# EAGLE design XbusTCO_smd (EAGLE 9.2.1)
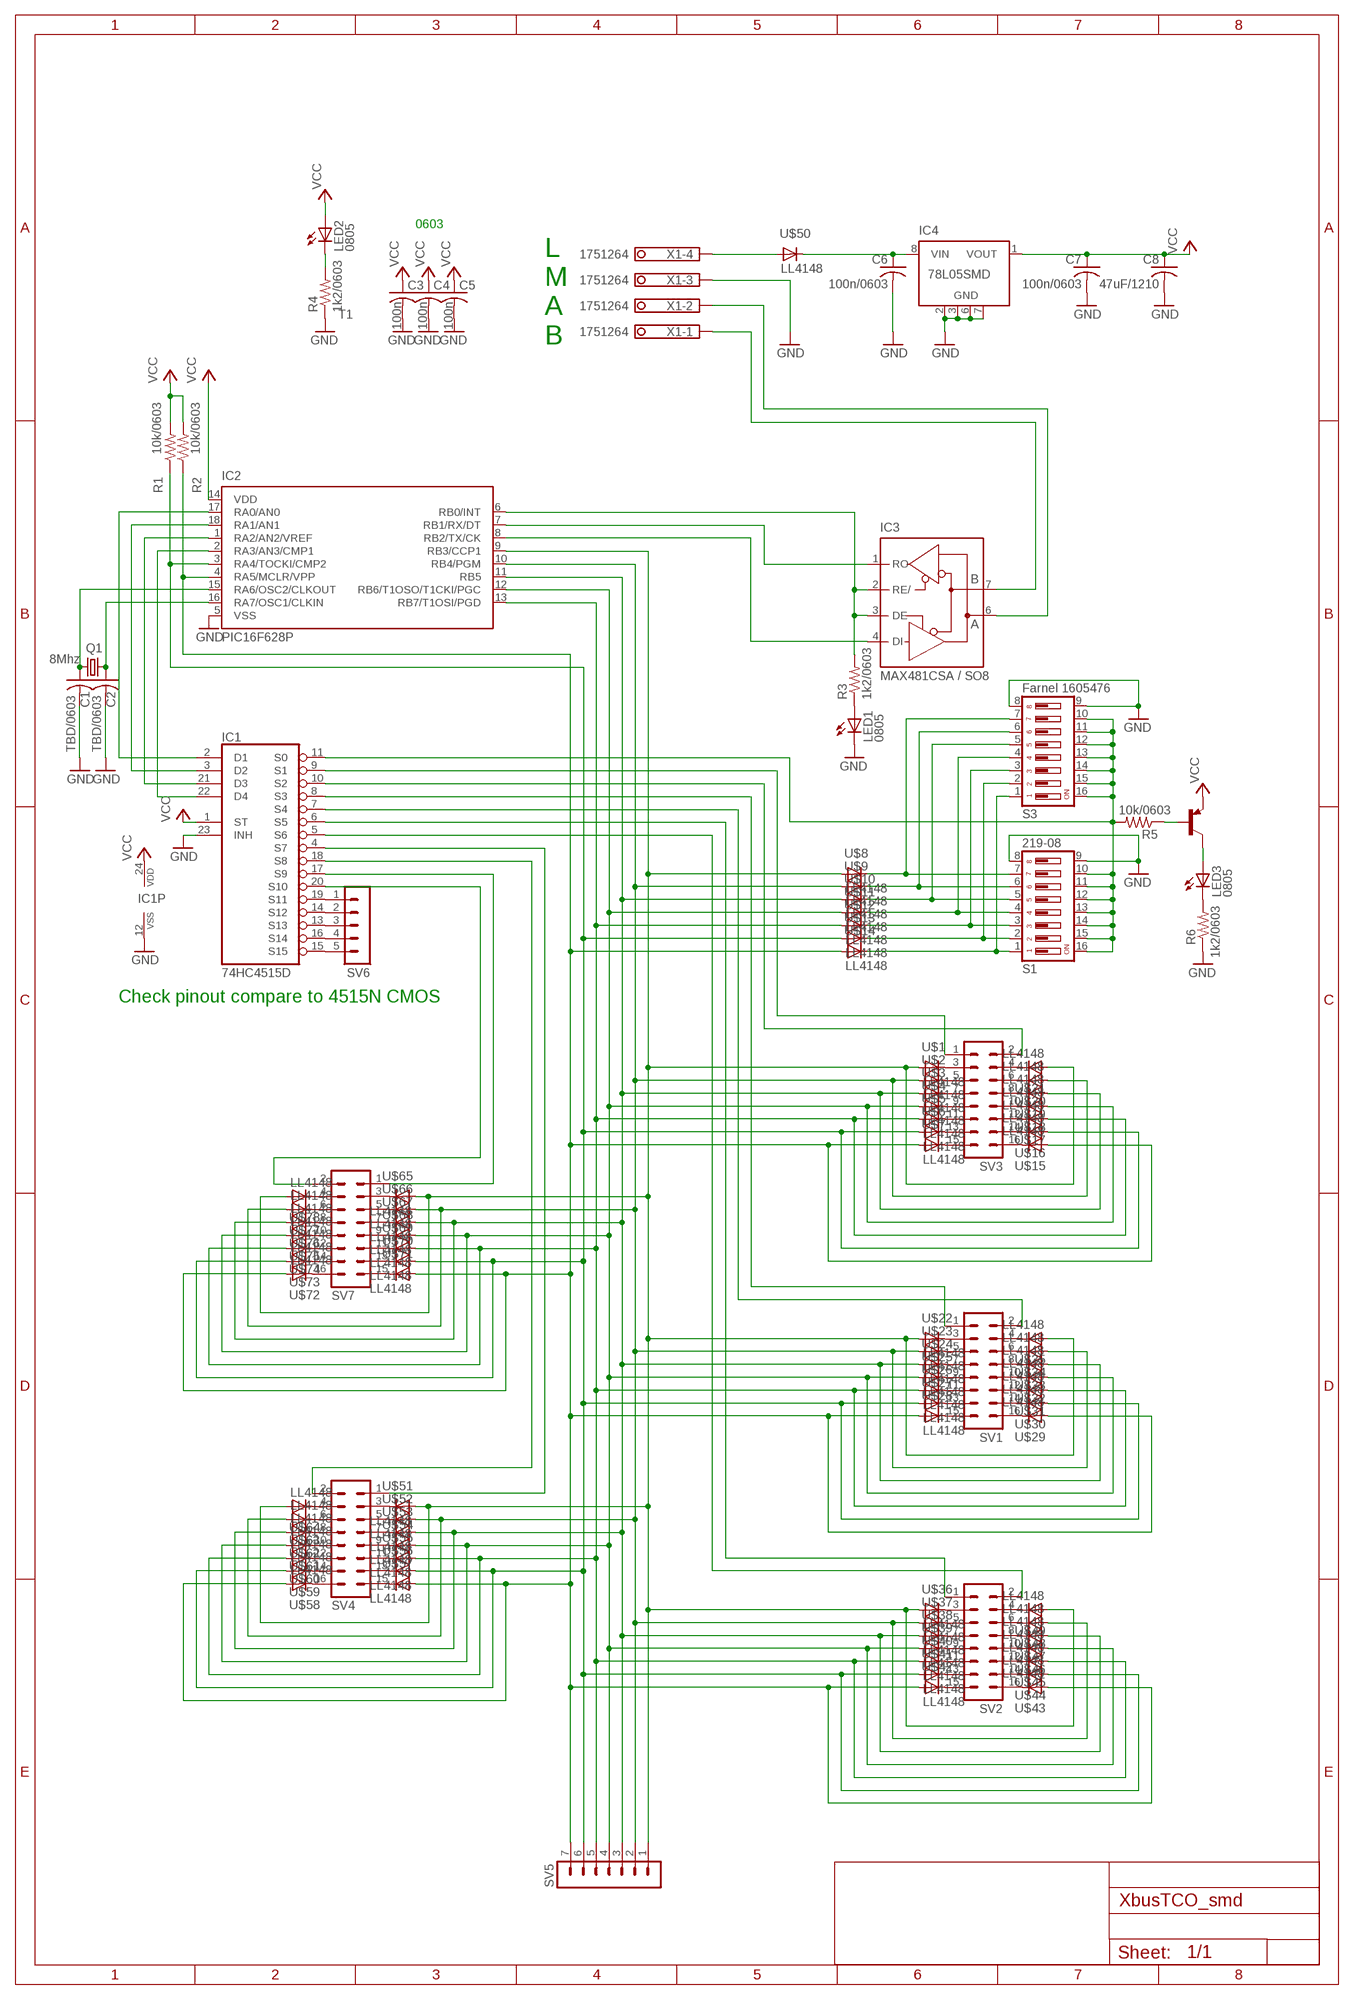
[diagram p0: schematic, sheet 1]

## Parts
C1  TBD/0603  C-USC0603  [C0603]
C2  TBD/0603  C-USC0603  [C0603]
C3  100n  C-USC0603  [C0603]
C4  100n  C-USC0603  [C0603]
C5  100n  C-USC0603  [C0603]
C6  100n/0603  C-USC0603  [C0603]
C7  100n/0603  C-USC0603  [C0603]
C8  47uF/1210  C-USC1210  [C1210]
IC1  74HC4515D  4515D  [SO24W]
IC2  PIC16F628P  [DIL18]
IC3  MAX481CSA / SO8  MAX481CSA  [SO08]
IC4  78L05SMD  [SO08]
LED1  0805  LEDCHIPLED_0805  [CHIPLED_0805]
LED2  0805  LEDCHIPLED_0805  [CHIPLED_0805]
LED3  0805  LEDCHIPLED_0805  [CHIPLED_0805]
Q1  8Mhz  CRYSTALHC49U70  [HC49U70]
R1  10k/0603  R-US_R0603  [R0603]
R2  10k/0603  R-US_R0603  [R0603]
R3  1k2/0603  R-US_R0603  [R0603]
R4  1k2/0603  R-US_R0603  [R0603]
R5  10k/0603  R-US_R0603  [R0603]
R6  1k2/0603  R-US_R0603  [R0603]
S1  219-08  [CTS-219-08]
S3  Farnel 1605476  219-08J  [CTS-219-08J]
SV1  MA08-2W  [MA08-2W]
SV2  MA08-2W  [MA08-2W]
SV3  MA08-2W  [MA08-2W]
SV4  MA08-2W  [MA08-2W]
SV5  MA07-1  [MA07-1]
SV6  MA05-1  [MA05-1]
SV7  MA08-2W  [MA08-2W]
T1  BC857A-PNP-SOT23-BEC  [SOT23-BEC]
U$1  LL4148  [MINIMELF]
U$2  LL4148  [MINIMELF]
U$3  LL4148  [MINIMELF]
U$4  LL4148  [MINIMELF]
U$5  LL4148  [MINIMELF]
U$6  LL4148  [MINIMELF]
U$7  LL4148  [MINIMELF]
U$8  LL4148  [MINIMELF]
U$9  LL4148  [MINIMELF]
U$10  LL4148  [MINIMELF]
U$11  LL4148  [MINIMELF]
U$12  LL4148  [MINIMELF]
U$13  LL4148  [MINIMELF]
U$14  LL4148  [MINIMELF]
U$15  LL4148  [MINIMELF]
U$16  LL4148  [MINIMELF]
U$17  LL4148  [MINIMELF]
U$18  LL4148  [MINIMELF]
U$19  LL4148  [MINIMELF]
U$20  LL4148  [MINIMELF]
U$21  LL4148  [MINIMELF]
U$22  LL4148  [MINIMELF]
U$23  LL4148  [MINIMELF]
U$24  LL4148  [MINIMELF]
U$25  LL4148  [MINIMELF]
U$26  LL4148  [MINIMELF]
U$27  LL4148  [MINIMELF]
U$28  LL4148  [MINIMELF]
U$29  LL4148  [MINIMELF]
U$30  LL4148  [MINIMELF]
U$31  LL4148  [MINIMELF]
U$32  LL4148  [MINIMELF]
U$33  LL4148  [MINIMELF]
U$34  LL4148  [MINIMELF]
U$35  LL4148  [MINIMELF]
U$36  LL4148  [MINIMELF]
U$37  LL4148  [MINIMELF]
U$38  LL4148  [MINIMELF]
U$39  LL4148  [MINIMELF]
U$40  LL4148  [MINIMELF]
U$41  LL4148  [MINIMELF]
U$42  LL4148  [MINIMELF]
U$43  LL4148  [MINIMELF]
U$44  LL4148  [MINIMELF]
U$45  LL4148  [MINIMELF]
U$46  LL4148  [MINIMELF]
U$47  LL4148  [MINIMELF]
U$48  LL4148  [MINIMELF]
U$49  LL4148  [MINIMELF]
U$50  LL4148  [MINIMELF]
U$51  LL4148  [MINIMELF]
U$52  LL4148  [MINIMELF]
U$53  LL4148  [MINIMELF]
U$54  LL4148  [MINIMELF]
U$55  LL4148  [MINIMELF]
U$56  LL4148  [MINIMELF]
U$57  LL4148  [MINIMELF]
U$58  LL4148  [MINIMELF]
U$59  LL4148  [MINIMELF]
U$60  LL4148  [MINIMELF]
U$61  LL4148  [MINIMELF]
U$62  LL4148  [MINIMELF]
U$63  LL4148  [MINIMELF]
U$64  LL4148  [MINIMELF]
U$65  LL4148  [MINIMELF]
U$66  LL4148  [MINIMELF]
U$67  LL4148  [MINIMELF]
U$68  LL4148  [MINIMELF]
U$69  LL4148  [MINIMELF]
U$70  LL4148  [MINIMELF]
U$71  LL4148  [MINIMELF]
U$72  LL4148  [MINIMELF]
U$73  LL4148  [MINIMELF]
U$74  LL4148  [MINIMELF]
U$75  LL4148  [MINIMELF]
U$76  LL4148  [MINIMELF]
U$77  LL4148  [MINIMELF]
U$78  LL4148  [MINIMELF]
X1  1751264  [1751264]

## Nets
GND: C1.2 C2.2 C3.2 C4.2 C5.2 C6.2 C7.2 C8.2 IC1.12(VSS) IC1.23(INH) IC2.5(VSS) IC4.2(GND) IC4.3(GND) IC4.6(GND) IC4.7(GND) LED1.C R4.1 R6.1 S1.8 S1.9 S3.8 S3.9 X1.3
N$1: C1.1 IC2.15(RA6/OSC2/CLKOUT) Q1.2
N$2: C2.1 IC2.16(RA7/OSC1/CLKIN) Q1.1
N$3: IC1.2(D1) IC2.17(RA0/AN0)
N$4: IC1.3(D2) IC2.18(RA1/AN1)
N$5: IC1.21(D3) IC2.1(RA2/AN2/VREF)
N$6: IC1.22(D4) IC2.2(RA3/AN3/CMP1)
N$7: IC2.6(RB0/INT) IC3.2(RE/) IC3.3(DE) R3.2
N$8: IC2.8(RB2/TX/CK) IC3.4(DI)
N$9: IC2.7(RB1/RX/DT) IC3.1(RO)
N$10: IC2.9(RB3/CCP1) SV5.1 U$1.A U$8.A U$21.A U$22.A U$35.A U$36.A U$49.A U$51.A U$64.A U$65.A U$78.A
N$11: IC2.10(RB4/PGM) SV5.2 U$2.A U$9.A U$20.A U$23.A U$34.A U$37.A U$48.A U$52.A U$63.A U$66.A U$77.A
N$12: IC2.11(RB5) SV5.3 U$3.A U$10.A U$19.A U$24.A U$33.A U$38.A U$47.A U$53.A U$62.A U$67.A U$76.A
N$13: IC2.12(RB6/T1OSO/T1CKI/PGC) SV5.4 U$4.A U$11.A U$18.A U$25.A U$32.A U$39.A U$46.A U$54.A U$61.A U$68.A U$75.A
N$14: IC2.13(RB7/T1OSI/PGD) SV5.5 U$5.A U$12.A U$17.A U$26.A U$31.A U$40.A U$45.A U$55.A U$60.A U$69.A U$74.A
N$15: IC2.3(RA4/TOCKI/CMP2) R1.1 SV5.6 U$6.A U$13.A U$16.A U$27.A U$30.A U$41.A U$44.A U$56.A U$59.A U$70.A U$73.A
N$16: IC2.4(RA5/MCLR/VPP) R2.1 SV5.7 U$7.A U$14.A U$15.A U$28.A U$29.A U$42.A U$43.A U$57.A U$58.A U$71.A U$72.A
N$17: IC1.9(S1) SV3.1
N$18: IC1.10(S2) SV3.2
N$19: C6.1 IC4.8(VIN) U$50.C
N$20: U$50.A X1.4
N$21: IC1.6(S5) SV2.1
N$22: IC3.6(A) X1.2
N$23: SV3.3 U$1.C
N$24: SV3.5 U$2.C
N$25: SV3.7 U$3.C
N$26: SV3.9 U$4.C
N$27: SV3.11 U$5.C
N$28: SV3.13 U$6.C
N$29: SV3.15 U$7.C
N$30: IC1.11(S0) R5.2 S1.10 S1.11 S1.12 S1.13 S1.14 S1.15 S1.16 S3.10 S3.11 S3.12 S3.13 S3.14 S3.15 S3.16
N$31: S1.7 S3.7 U$8.C
N$32: S1.6 S3.6 U$9.C
N$33: S1.5 S3.5 U$10.C
N$34: S1.4 S3.4 U$11.C
N$35: S1.3 S3.3 U$12.C
N$36: S1.2 S3.2 U$13.C
N$37: S1.1 S3.1 U$14.C
N$38: SV3.16 U$15.C
N$39: SV3.14 U$16.C
N$40: SV3.12 U$17.C
N$41: SV3.10 U$18.C
N$42: SV3.8 U$19.C
N$43: SV3.6 U$20.C
N$44: SV3.4 U$21.C
N$45: IC3.7(B) X1.1
N$46: LED2.C R4.2
N$47: LED1.A R3.1
N$48: R5.1 T1.B
N$49: LED3.A T1.C
N$50: LED3.C R6.2
N$51: IC1.5(S6) SV2.2
N$52: IC1.8(S3) SV1.1
N$53: IC1.7(S4) SV1.2
N$54: SV1.3 U$22.C
N$55: SV1.5 U$23.C
N$56: SV1.7 U$24.C
N$57: SV1.9 U$25.C
N$58: SV1.11 U$26.C
N$59: SV1.13 U$27.C
N$60: SV1.15 U$28.C
N$61: SV1.16 U$29.C
N$62: SV1.14 U$30.C
N$63: SV1.12 U$31.C
N$64: SV1.10 U$32.C
N$65: SV1.8 U$33.C
N$66: SV1.6 U$34.C
N$67: SV1.4 U$35.C
N$68: SV2.3 U$36.C
N$69: SV2.5 U$37.C
N$70: SV2.7 U$38.C
N$71: SV2.9 U$39.C
N$72: SV2.11 U$40.C
N$73: SV2.13 U$41.C
N$74: SV2.15 U$42.C
N$75: SV2.16 U$43.C
N$76: SV2.14 U$44.C
N$77: SV2.12 U$45.C
N$78: SV2.10 U$46.C
N$79: SV2.8 U$47.C
N$80: SV2.6 U$48.C
N$81: SV2.4 U$49.C
N$82: IC1.4(S7) SV4.1
N$83: IC1.18(S8) SV4.2
N$84: IC1.17(S9) SV7.1
N$85: IC1.20(S10) SV7.2
N$86: IC1.19(S11) SV6.1
N$87: IC1.14(S12) SV6.2
N$88: IC1.13(S13) SV6.3
N$89: IC1.16(S14) SV6.4
N$90: IC1.15(S15) SV6.5
N$96: SV7.3 U$65.C
N$97: SV7.5 U$66.C
N$98: SV4.3 U$51.C
N$99: SV4.5 U$52.C
N$100: SV4.7 U$53.C
N$101: SV4.9 U$54.C
N$102: SV4.11 U$55.C
N$103: SV4.13 U$56.C
N$104: SV4.15 U$57.C
N$105: SV4.16 U$58.C
N$106: SV4.14 U$59.C
N$107: SV4.12 U$60.C
N$108: SV4.10 U$61.C
N$109: SV4.8 U$62.C
N$110: SV4.6 U$63.C
N$111: SV4.4 U$64.C
N$112: SV7.7 U$67.C
N$113: SV7.9 U$68.C
N$114: SV7.11 U$69.C
N$115: SV7.13 U$70.C
N$116: SV7.15 U$71.C
N$117: SV7.16 U$72.C
N$118: SV7.14 U$73.C
N$119: SV7.12 U$74.C
N$120: SV7.10 U$75.C
N$121: SV7.8 U$76.C
N$122: SV7.6 U$77.C
N$123: SV7.4 U$78.C
VCC: C3.1 C4.1 C5.1 C7.1 C8.1 IC1.1(ST) IC1.24(VDD) IC2.14(VDD) IC4.1(VOUT) LED2.A R1.2 R2.2 T1.E
Unconnected: IC4.4(NC) IC4.5(NC)

## Notes on the sheet
- 0603
- L
  M
  A
  B
- Check pinout compare to 4515N CMOS

## Power pins joined to a net without a drawn wire
GND: IC3.5(GND)
VCC: IC3.8(VCC)

## Library data of the parts
C1-C8 = rcl:C-US: CAPACITOR, American symbol; SPICEPREFIX: C
IC1 = 45xx:4515: 4-bit latch 4-16 line DECODER
IC2 = microchip:PIC16F62*: FLASH-Based 8-Bit CMOS Microcontroller Source: http://ww1.microchip.com/downloads/en/DeviceDoc/40300C.pdf; MF: MICROCHIP; MPN: PIC16F628-04I/P; OC_FARNELL: 9760407; OC_NEWARK: 19C7272
IC3 = maxim:MAX481CSA: RS485 TRANSEIVER; MF: MAXIM; MPN: MAX481CSA; OC_FARNELL: unknown; OC_NEWARK: 90C3817
IC4 = linear:78L*SMD: Positive VOLTAGE REGULATOR
LED1-LED3 = led:LED: LED OSRAM: - CHIPLED LG R971, LG N971, LY N971, LG Q971, LY Q971, LO R971, LY R971 LH N974, LH R974 LS Q976, LO Q976, LY Q976 LO Q996 - Hyper CHIPLED LW Q18S LB Q993, LB Q99A, LB R99A - SideLED LS A670, LO A670, LY A670, LG A670, LP A670 LB A673, LV A673, LT A673, LW A673 LH A674 LY A675 LS A676, LA A676, LO A676, LY A676, LW A676 LS A679, LY A679, LG A679 - Hyper Micro SIDELED® LS Y876, LA Y876, LO Y876, LY Y876 LT Y87S - SmartLED LW L88C, LW L88S LB L89C, LB L89S, LG L890 LS L89K, LO L89K, LY L89K LS L896, LA L896, LO L896, LY L896 - TOPLED LS T670, LO T670, LY T670, LG T670, LP T670 LSG T670, LSP T670, LSY T670, LOP T670, LYG T670 LG T671, LOG T671, LSG T671 LB T673, LV T673, LT T673, LW T673 LH T674 LS T676, LA T676, LO T676, LY T676, LB T676, LH T676, LSB T676, LW T676 LB T67C, LV T67C, LT T67C, LS T67K, LO T67K, LY T67K, LW E67C LS E67B, LA E67B, LO E67B, LY E67B, LB E67C, LV E67C, LT E67C LW T67C LS T679, LY T679, LG T679 LS T770, LO T770, LY T770, LG T770, LP T770 LB T773, LV T773, LT T773, LW T773 LH T774 LS E675, LA E675, LY E675, LS T675 LS T776, LA T776, LO T776, LY T776, LB T776 LHGB T686 LT T68C, LB T68C - Hyper Mini TOPLED® LB M676 - Mini TOPLED Santana® LG M470 LS M47K, LO M47K, LY M47K Source: http://www.osram.convergy.de LUXEON: - LUMILED® LXK2-PW12-R00, LXK2-PW12-S00, LXK2-PW14-U00, LXK2-PW14-V00 LXK2-PM12-R00, LXK2-PM12-S00, LXK2-PM14-U00 LXK2-PE12-Q00, LXK2-PE12-R00, LXK2-PE12-S00, LXK2-PE14-T00, LXK2-PE14-U00 LXK2-PB12-K00, LXK2-PB12-L00, LXK2-PB12-M00, LXK2-PB14-N00, LXK2-PB14-P00, LXK2-PB14-Q00 LXK2-PR12-L00, LXK2-PR12-M00, LXK2-PR14-Q00, LXK2-PR14-R00 LXK2-PD12-Q00, LXK2-PD12-R00, LXK2-PD12-S00 LXK2-PH12-R00, LXK2-PH12-S00 LXK2-PL12-P00, LXK2-PL12-Q00, LXK2-PL12-R00 Source: www.luxeon.com KINGBRIGHT: KA-3528ASYC Source: www.kingbright.com
Q1 = crystal:CRYSTAL: CRYSTAL; OC_FARNELL: unknown; OC_NEWARK: unknown
R1-R6 = rcl:R-US_: RESISTOR, American symbol; SPICEPREFIX: R
S1 S3 = switch-dil:219-08*: Surface Mount DIP Switch Series 219 SMT CTS Electronic Components Sourc: www.ctscorp.com; OC_FARNELL: unknown; OC_NEWARK: unknown
SV1-SV4 SV7 = con-lstb:MA08-2W: PIN HEADER; OC_FARNELL: unknown; OC_NEWARK: unknown
SV5 = con-lstb:MA07-1: PIN HEADER; OC_FARNELL: unknown; OC_NEWARK: unknown
SV6 = con-lstb:MA05-1: PIN HEADER; OC_FARNELL: unknown; OC_NEWARK: unknown
T1 = transistor:*-PNP-: PNP Transistror
U$1-U$78 = LL4148:LL4148: Bootstrap-Diode von VISHEY LL4148-GS08; AVAILABILITY: Unavailable; DESCRIPTION: Surface Mount Switching Glass; MF: ON Semiconductor; MP: LL4148; PACKAGE: SOD-80 Taitron; PRICE: None
X1 = con-phoenix-350:1751264: MKDS 1/ 4-3,5 Printklemme Nennstrom: 10 A Bemessungsspannung: 160 V Raster: 3,5 mm Polzahl: 4 Montageart: Löten Anschlussart: Schraubanschluss Anschlussrichtung vom Leiter zur Platine: 0° Source: http://eshop.phoenixcontact.com .. 1751264.pdf; MPN: 1751264; OC_FARNELL: unknown; OC_NEWARK: 10R0934

## Board
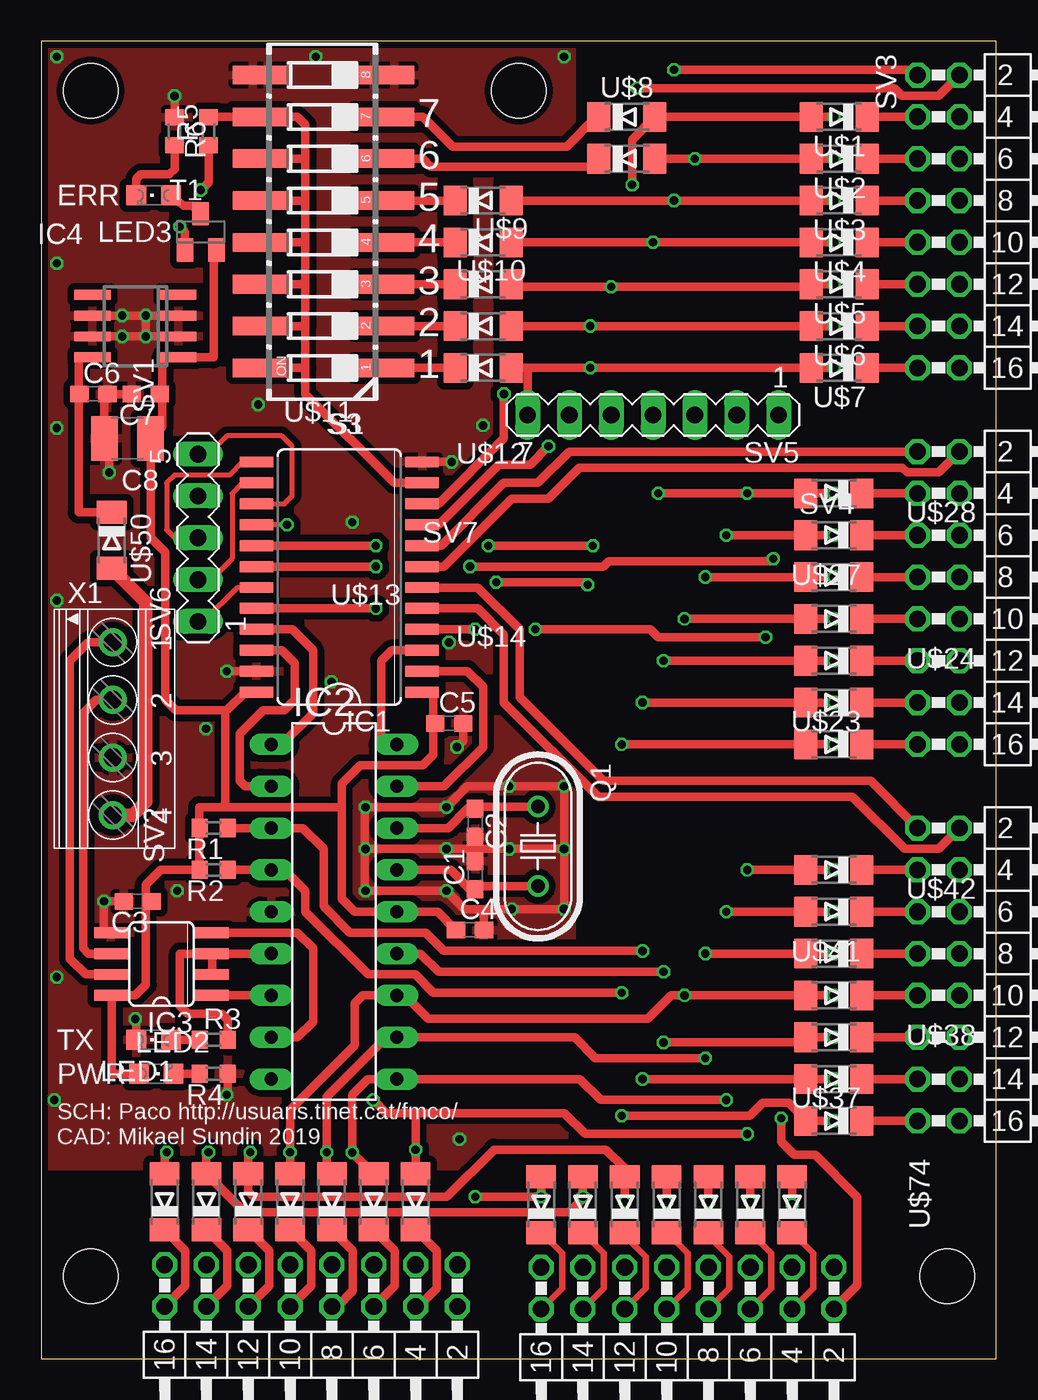
[diagram p1: board, top side]
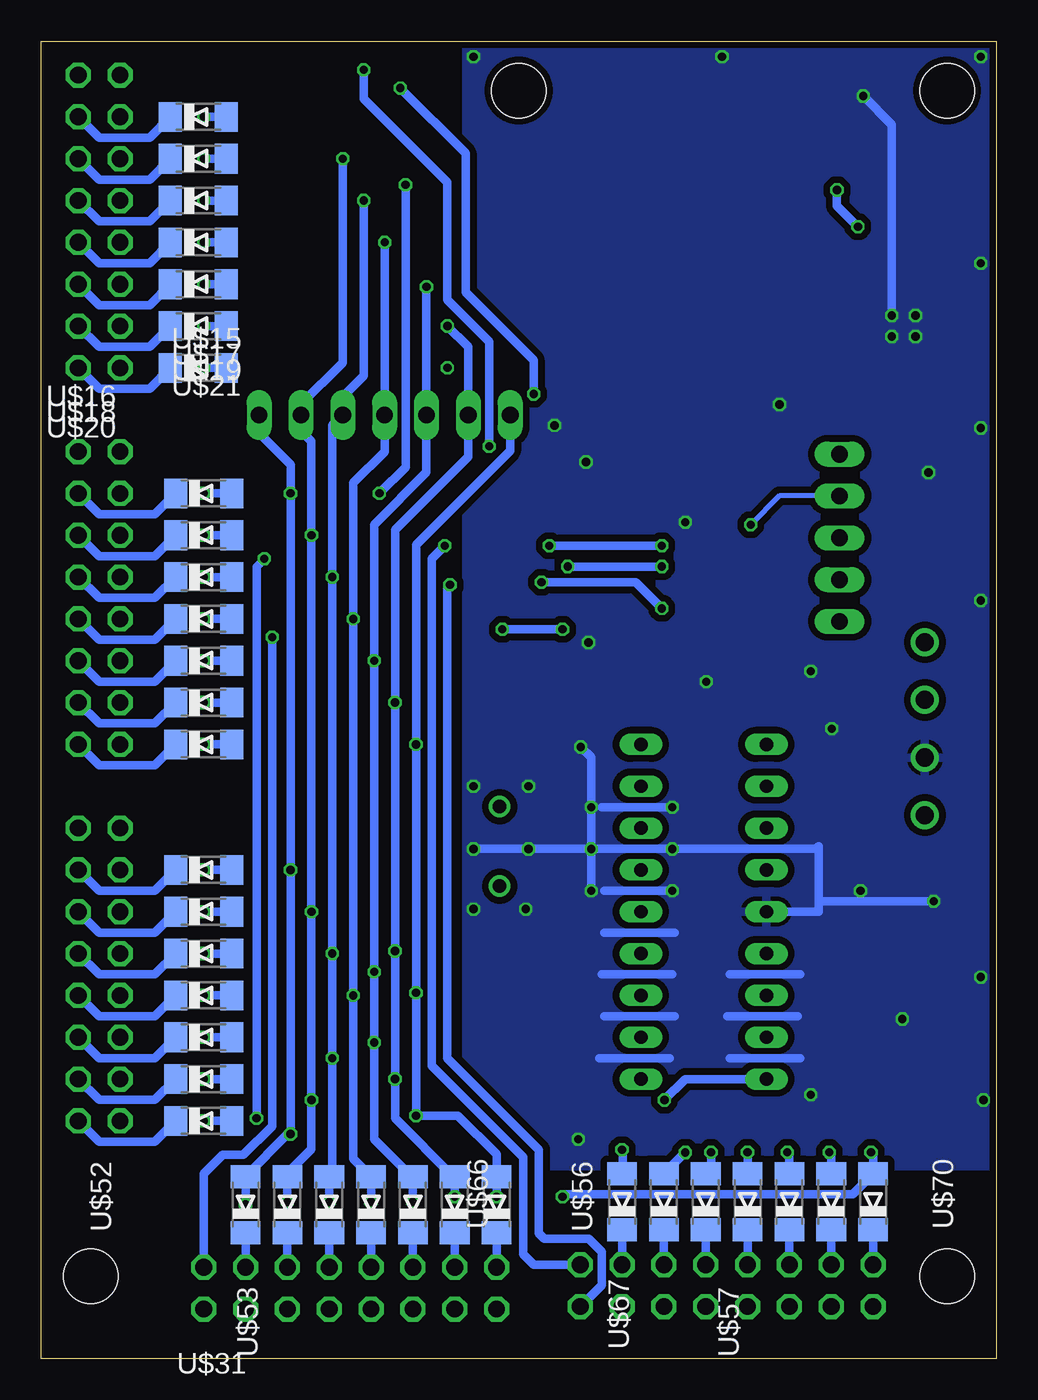
[diagram p2: board, bottom side, seen from below]

Size 58 x 80 mm. Coordinates in mm from the lower left corner, seen from the top.
Outline: 0,0 58,0 58,80 0,80 0,0
Copper layers (1*16): Top 0.035mm / dielectric 1.5mm / Bottom 0.035mm
Design rules "aisler_2_layer": minimum track width 0.1mm, minimum drill 0.2mm, track to track 0.1mm, track to pad 0.1mm, pad to pad 0.1mm, via to via 0.1mm, smd to smd 0.1mm, copper to edge 0.2mm, drill to drill 0.21mm, minimum pad ring 0.25mm, minimum via ring 0.15mm, stop-mask expansion 0mil, vias tented up to drill 0mil, thermal gap 10mil
Holes 3.3 mm at 55,5 29,77 3,5 3,77

### Footprints (pad centres in the part's own frame; a part is rotated, then mirrored left to right if it is on the bottom)
C0603 = smd 1.1 x 1: 1 -0.85,0; 2 0.85,0
C1210 = smd 1.6 x 2.7: 1 -1.4,0; 2 1.4,0
SO24W = smd 0.66 x 2.032: 1 -6.985,-5.029; 2 -5.715,-5.029; 3 -4.445,-5.029; 4 -3.175,-5.029; 5 -1.905,-5.029; 6 -0.635,-5.029; 7 0.635,-5.029; 8 1.905,-5.029; 9 3.175,-5.029; 10 4.445,-5.029; 11 5.715,-5.029; 12 6.985,-5.029; 13 6.985,5.029; 14 5.715,5.029; 15 4.445,5.029; 16 3.175,5.029; 17 1.905,5.029; 18 0.635,5.029; 19 -0.635,5.029; 20 -1.905,5.029; 21 -3.175,5.029; 22 -4.445,5.029; 23 -5.715,5.029; 24 -6.985,5.029
DIL18 = drill 0.813 long: 1 -10.16,-3.81; 2 -7.62,-3.81; 3 -5.08,-3.81; 4 -2.54,-3.81; 5 0,-3.81; 6 2.54,-3.81; 7 5.08,-3.81; 8 7.62,-3.81; 9 10.16,-3.81; 10 10.16,3.81; 11 7.62,3.81; 12 5.08,3.81; 13 2.54,3.81; 14 0,3.81; 15 -2.54,3.81; 16 -5.08,3.81; 17 -7.62,3.81; 18 -10.16,3.81
SO08 = smd 0.66 x 2.032: 1 -1.905,-3.073; 2 -0.635,-3.073; 3 0.635,-3.073; 4 1.905,-3.073; 5 1.905,3.073; 6 0.635,3.073; 7 -0.635,3.073; 8 -1.905,3.073
SO08' = smd 0.6 x 2.2: 1 -1.905,-2.6; 2 -0.635,-2.6; 3 0.635,-2.6; 4 1.905,-2.6; 5 1.905,2.6; 6 0.635,2.6; 7 -0.635,2.6; 8 -1.905,2.6
CHIPLED_0805 = smd 1.2 x 1.2: A 0,-1.05; C 0,1.05
HC49U70 = drill 0.813: 1 -2.413,0; 2 2.413,0
R0603 = smd 1 x 1.1: 1 -0.85,0; 2 0.85,0
CTS-219-08 = smd 1.13 x 2.44: 1 -8.89,-4.3; 2 -6.35,-4.3; 3 -3.81,-4.3; 4 -1.27,-4.3; 5 1.27,-4.3; 6 3.81,-4.3; 7 6.35,-4.3; 8 8.89,-4.3; 9 8.89,4.3; 10 6.35,4.3; 11 3.81,4.3; 12 1.27,4.3; 13 -1.27,4.3; 14 -3.81,4.3; 15 -6.35,4.3; 16 -8.89,4.3
CTS-219-08J = smd 1.13 x 2.44: 1 -8.89,-3.215; 2 -6.35,-3.215; 3 -3.81,-3.215; 4 -1.27,-3.215; 5 1.27,-3.215; 6 3.81,-3.215; 7 6.35,-3.215; 8 8.89,-3.215; 9 8.89,3.215; 10 6.35,3.215; 11 3.81,3.215; 12 1.27,3.215; 13 -1.27,3.215; 14 -3.81,3.215; 15 -6.35,3.215; 16 -8.89,3.215
MA08-2W = drill 1.016 octagon: 1 -8.89,-1.27; 2 -8.89,1.27; 3 -6.35,-1.27; 4 -6.35,1.27; 5 -3.81,-1.27; 6 -3.81,1.27; 7 -1.27,-1.27; 8 -1.27,1.27; 9 1.27,-1.27; 10 1.27,1.27; 11 3.81,-1.27; 12 3.81,1.27; 13 6.35,-1.27; 14 6.35,1.27; 15 8.89,-1.27; 16 8.89,1.27
MA07-1 = drill 1.016 long: 1 -7.62,0; 2 -5.08,0; 3 -2.54,0; 4 0,0; 5 2.54,0; 6 5.08,0; 7 7.62,0
MA05-1 = drill 1.016 long: 1 -5.08,0; 2 -2.54,0; 3 0,0; 4 2.54,0; 5 5.08,0
SOT23-BEC = smd 1 x 1.4: B -0.95,-1.1; C 0,1.1; E 0.95,-1.1
MINIMELF = smd 1.4 x 1.8: A 1.7,0; C -1.7,0
1751264 = drill 1.1 pad 1.7: 1 -5.25,-0.1; 2 -1.75,-0.1; 3 1.75,-0.1; 4 5.25,-0.1

### Placement (x,y rotation side)
C1  26.35,29.37 90 top
C2  26.35,32.54 270 top
C3  5.87,27.78 180 top
C4  26.04,26.03 0 top
C5  24.77,38.58 0 top
C6  3.17,58.58 0 top
C7  6.35,58.58 180 top
C8  5.24,55.88 180 top
IC1  18.1,47.47 90 top
IC2  17.78,27.14 270 top
IC3  7.3,23.97 90 top
IC4  78L05SMD  [SO08']  5.71,62.7 90 top
LED1  6.83,19.37 90 top
LED2  6.99,17.3 270 top
LED3  6.83,70.64 90 top
Q1  30.16,31.11 270 top
R1  10.48,32.23 180 top
R2  10.48,29.68 180 top
R3  10.48,19.37 0 top
R4  10.48,17.3 180 top
R5  10.16,74.53 90 top
R6  8.1,74.53 270 top
S1  17.14,69.06 90 top
S3  16.99,69.06 90 top
SV1  54.48,46.2 270 top
SV2  54.48,23.34 270 top
SV3  54.48,69.06 270 top
SV4  39.24,4.29 180 top
SV5  37.15,57.31 180 top
SV6  9.53,49.85 90 top
SV7  16.38,4.45 180 top
T1  9.68,68.42 0 top
U$1  48.45,75.41 180 top
U$2  48.45,72.86 180 top
U$3  48.45,70.33 180 top
U$4  48.45,67.78 180 top
U$5  48.45,65.25 180 top
U$6  48.45,62.7 180 top
U$7  48.45,60.16 180 top
U$8  35.56,75.41 0 top
U$9  35.56,72.86 0 top
U$10  26.83,70.33 0 top
U$11  26.83,67.78 0 top
U$12  26.83,65.25 0 top
U$13  26.83,62.7 0 top
U$14  26.83,60.16 0 top
U$15  48.45,60.16 0 bottom
U$16  48.45,62.7 0 bottom
U$17  48.45,65.25 0 bottom
U$18  48.45,67.78 0 bottom
U$19  48.45,70.33 0 bottom
U$20  48.45,72.86 0 bottom
U$21  48.45,75.41 0 bottom
U$22  48.13,52.55 180 top
U$23  48.13,50.01 180 top
U$24  48.13,47.47 180 top
U$25  48.13,44.92 180 top
U$26  48.13,42.38 180 top
U$27  48.13,39.84 180 top
U$28  48.13,37.3 180 top
U$29  48.13,37.3 0 bottom
U$30  48.13,39.84 0 bottom
U$31  48.13,42.38 0 bottom
U$32  48.13,44.92 0 bottom
U$33  48.13,47.47 0 bottom
U$34  48.13,50.01 0 bottom
U$35  48.13,52.55 0 bottom
U$36  48.13,29.68 180 top
U$37  48.13,27.14 180 top
U$38  48.13,24.61 180 top
U$39  48.13,22.07 180 top
U$40  48.13,19.52 180 top
U$41  48.13,16.98 180 top
U$42  48.13,14.45 180 top
U$43  48.13,14.45 0 bottom
U$44  48.13,16.98 0 bottom
U$45  48.13,19.52 0 bottom
U$46  48.13,22.07 0 bottom
U$47  48.13,24.61 0 bottom
U$48  48.13,27.14 0 bottom
U$49  48.13,29.68 0 bottom
U$50  4.29,49.69 270 top
U$51  45.59,9.37 90 bottom
U$52  43.05,9.37 90 bottom
U$53  40.51,9.37 90 bottom
U$54  37.97,9.37 90 bottom
U$55  35.43,9.37 90 bottom
U$56  32.89,9.37 90 bottom
U$57  30.35,9.37 90 bottom
U$58  30.35,9.37 90 top
U$59  32.89,9.37 90 top
U$60  35.43,9.37 90 top
U$61  37.97,9.37 90 top
U$62  40.51,9.37 90 top
U$63  43.05,9.37 90 top
U$64  45.59,9.37 90 top
U$65  22.73,9.53 90 bottom
U$66  20.19,9.53 90 bottom
U$67  17.65,9.53 90 bottom
U$68  15.11,9.53 90 bottom
U$69  12.57,9.53 90 bottom
U$70  10.03,9.53 90 bottom
U$71  7.49,9.53 90 bottom
U$72  7.49,9.53 90 top
U$73  10.03,9.53 90 top
U$74  12.57,9.53 90 top
U$75  15.11,9.53 90 top
U$76  17.65,9.53 90 top
U$77  20.19,9.53 90 top
U$78  22.73,9.53 90 top
X1  4.45,38.26 270 top

### Tracks (layer width: path | path; a pad name or v marks a point on that pad's centre or on a via)
GND  (via drill 0.5)
  Top 0.508: IC3.5 3.81,25.88 v3.81,27.78 C3.2 | IC4.3 v6.35,63.34 | IC1.12 v24.92,54.45 | IC4.6 v6.35,63.34 | IC4.7 v6.35,62.07 | v6.35,62.07 IC4.2 | v6.35,63.34 v6.35,62.07 | R6.1 v8.1,76.67 | v31.75,30.95 31.81,31.01 | v31.75,30.95 31.81,30.9 | 26.83,27.3 31.81,27.3 31.75,27.36 v31.75,30.95 | 26.83,27.3 25.72,27.3 v24.61,28.41 19.66,28.41 19.66,33.49 v24.61,33.49 25.88,34.77 31.81,34.77 | v19.68,30.95 26.35,30.95 | 26.35,30.95 v31.75,30.95 | C5.2 25.61,37.52 v25.24,37.15 25.4,37.3 | v31.75,34.77 v31.75,30.95 | C2.2 26.35,30.95 | C1.2 26.35,30.95 | C4.2 26.89,27.25 26.83,27.3 | v4.13,53.81 4.13,55.59 C8.2 3.84,58.39 C6.2 | 4.13,58.58 C6.2 | C7.2 C6.2 | R4.1 11.33,16.09 v11.27,16.03 | v5.71,20.64 5.78,20.57 LED1.C | IC1.23 v11.27,41.75
  Bottom 0.508: 10.79,27.78 v3.81,27.78 | IC2.5 10.79,27.14 10.79,27.78 | 10.79,27.78 10.79,31.11 10.95,30.95 v24.61,30.95 | v31.75,30.95 v24.61,30.95 | v25.24,37.15 24.61,36.51 v24.61,33.49 v24.61,30.95 | v24.61,28.41 v24.61,30.95 | v8.1,76.67 6.35,74.93 v6.35,63.34 | 19.84,18.26 24.13,18.26 | 11.91,18.26 16.19,18.26 | 19.53,20.8 23.81,20.8 | 12.06,20.8 16.35,20.8 | 11.91,23.34 16.19,23.34 | 19.68,23.34 23.97,23.34 | 19.53,25.88 23.81,25.88 | 19.53,28.42 23.81,28.42 | v19.68,33.5 23.97,33.5
  other vias: 17.62,41.12 19.68,28.41 31.75,27.3 28.42,30.95 28.42,34.77 28.57,27.3 4.92,63.34 4.92,62.07 25.4,13.33 0.79,15.71 0.95,79.06 31.75,79.06 26.83,56.67 0.95,46.04 0.95,23.18 16.67,79.06 0.95,66.52 0.95,56.51 24.77,43.5 8.26,28.41 10,38.26 13.18,57.94 18.89,50.8
  pour Bottom (isolate 0.406): -2,94.64 32.2,94.64 32.2,11.7 -2,11.7
  pour Top (isolate 0.406): -2,94.64 32.2,94.64 32.2,11.7 -2,11.7
N$1
  Top 0.508: Q1.2 26.54,28.7 C1.1 26.04,28.52 24.87,29.68 IC2.15
N$2
  Top 0.508: Q1.1 26.49,33.53 C2.1 25.88,33.39 24.71,32.23 IC2.16
N$3
  Top 0.508: IC1.2 25.88,41.75 26.83,40.8 26.83,37.15 24.45,34.77 IC2.17
N$4
  Top 0.508: IC1.3 21.27,43.02 20.64,42.38 20.64,37.3 IC2.18
N$5
  Top 0.508: IC2.1 14.61,37.3 16.51,39.21 16.51,43.02 15.24,44.29 IC1.21
N$6
  Top 0.508: IC2.2 12.38,34.77 12.06,35.08 12.06,37.94 13.49,39.37 14.76,39.37 15.4,40 15.4,42.23 14.61,43.02 IC1.22
N$7
  Top 0.508: IC3.2 IC3.3 | IC2.6 IC3.3 | IC3.3 8.41,24.61 8.41,21.43 8.89,20.95 10.95,20.95 11.33,20.58 R3.2
N$8
  Top 0.508: IC3.4 15.56,25.88 16.51,24.92 16.51,20.48 15.56,19.52 IC2.8
N$9
  Top 0.508: IC2.7 IC3.1
N$10  (via drill 0.5)
  Top 0.508: v35.88,71.28 35.88,74.02 U$8.A U$21.A v48.13,75.41 | v48.13,52.55 U$35.A v42.86,52.55 v37.47,52.55 | v42.86,29.68 U$49.A v48.13,29.68 | v45.59,9.37 U$64.A | U$78.A v22.73,12.7 22.73,14.89 22.7,14.92 | 22.7,14.92 31.75,14.92 33.02,13.65 v42.86,13.65 | 22.7,14.92 20.95,14.92 v20.16,15.72
  Bottom 0.508: v48.13,52.55 U$35.A | U$21.A v48.13,75.41 | U$49.A v48.13,29.68 | v35.88,71.28 35.88,54.13 v37.47,52.55 | U$51.A v45.59,9.37 U$64.A 43.02,13.65 v42.86,13.65 v42.86,29.68 v42.86,52.55 42.86,54.29 44.77,56.2 SV5.1 | IC2.9 18.89,16.98 v20.16,15.72 | U$78.A 22.7,11.26 22.7,12.7 v22.73,12.7
N$11  (via drill 0.5)
  Top 0.508: U$9.A v39.69,72.86 U$20.A v48.13,72.86 | v41.59,50.01 U$34.A v48.13,50.01 | v41.59,27.14 U$48.A v48.13,27.14 | v41.59,15.71 33.97,15.71 32.7,16.98 IC2.10 19.84,16.98 18.89,16.03 v18.89,12.53 U$77.A | v43.05,9.53 U$63.A
  Bottom 0.508: U$34.A v48.13,50.01 | U$20.A v48.13,72.86 | U$48.A v48.13,27.14 | v39.69,72.86 39.69,60.48 42.23,57.94 SV5.2 42.23,56.35 41.59,55.72 v41.59,50.01 v41.59,27.14 v41.59,15.71 41.59,12.73 43.05,11.27 v43.05,9.53 U$52.A | U$77.A 19.04,12.38 18.89,12.38 v18.89,12.53
N$12  (via drill 0.5)
  Top 0.508: U$10.A v38.42,70.33 U$19.A v48.13,70.33 | v40.32,47.47 U$33.A v48.13,47.47 | v40.32,24.61 U$47.A v48.13,24.61 | v40.32,18.25 33.66,18.25 32.38,19.52 IC2.11 20.95,19.52 17.34,15.91 v17.34,12.54 17.34,11.54 U$76.A | v40.51,9.53 U$62.A
  Bottom 0.508: U$33.A v48.13,47.47 | U$19.A v48.13,70.33 | U$47.A v48.13,24.61 | v38.42,70.33 38.42,59.69 39.69,58.42 SV5.3 40.32,56.67 v40.32,47.47 v40.32,24.61 v40.32,18.25 40.32,11.26 U$53.A v40.51,9.53 | U$76.A 17.3,11.57 17.3,12.54 v17.34,12.54
N$13  (via drill 0.5)
  Top 0.508: U$11.A v37.15,67.78 U$18.A v48.13,67.78 | v39.05,44.92 U$32.A v48.13,44.92 | v48.13,22.07 U$46.A v39.05,22.07 38.26,22.07 36.83,20.64 23.5,20.64 22.07,22.07 IC2.12 19.52,22.07 19.05,21.59 19.05,19.05 15.11,15.11 v15.11,12.54 U$75.A | v37.97,9.53 U$61.A
  Bottom 0.508: v37.15,67.78 SV5.4 37.15,55.09 39.05,53.18 v39.05,44.92 v39.05,22.07 39.05,12.14 U$54.A v37.97,9.53 | U$32.A v48.13,44.92 | U$18.A v48.13,67.78 | U$46.A v48.13,22.07 | v15.11,12.54 U$75.A
N$14  (via drill 0.5)
  Top 0.508: U$12.A 28.69,65.09 v34.61,65.09 46.59,65.09 U$17.A v48.13,65.25 | v37.78,42.38 U$31.A v48.13,42.38 | v37.78,19.21 46.12,19.21 U$45.A v48.13,19.52 | v37.78,23.49 24.13,23.49 23.02,24.61 IC2.13 | v35.43,9.53 U$60.A 35.43,11.56 34.29,12.7 27.5,12.7 24.64,9.84 12.89,9.84 12.57,10.16 U$74.A 12.57,12.41 v12.7,12.54
  Bottom 0.508: U$31.A v48.13,42.38 | U$17.A v48.13,65.25 | U$45.A v48.13,19.52 | v34.61,65.09 SV5.5 34.61,53.81 37.78,50.64 v37.78,42.38 v37.78,23.49 v37.78,19.21 37.78,13.34 35.51,11.06 U$55.A v35.43,9.53 | v12.7,12.54 12.57,12.41 U$74.A
N$15  (via drill 0.5)
  Top 0.508: U$13.A v33.34,62.7 U$16.A v48.13,62.7 | v36.51,39.84 U$30.A v48.13,39.84 | v36.51,16.98 U$44.A v48.13,16.98 | R1.1 IC2.3 15.88,32.23 17.14,30.95 17.14,27.46 18.73,25.88 23.34,25.88 24.45,24.76 v36.51,24.76 | U$59.A v32.89,9.84 32.89,9.71 32.07,8.89 12.37,8.89 U$73.A 10.03,12.41 v10.16,12.54
  Bottom 0.508: U$30.A v48.13,39.84 | U$16.A v48.13,62.7 | U$44.A v48.13,16.98 | v33.34,62.7 32.07,61.44 SV5.6 32.07,54.77 36.51,50.32 v36.51,39.84 v36.51,24.76 v36.51,16.98 36.51,14.61 32.97,11.06 U$56.A v32.89,9.84 | v10.16,12.54 10.03,12.41 U$73.A
N$16  (via drill 0.5)
  Top 0.508: U$14.A 29.53,60.16 | v35.24,37.3 U$29.A v48.13,37.3 | v48.13,60.16 U$15.A v33.34,60.16 29.53,60.16 | v48.13,14.45 U$43.A 46.43,14.53 45.4,15.56 43.81,15.56 43.02,14.76 v35.24,14.76 | R2.1 IC2.4 14.76,29.68 16.03,28.41 16.03,27.14 19.84,23.34 22.7,23.34 23.81,22.22 v35.24,22.22 | SV5.7 29.53,60.16 | U$58.A v30.35,9.84 v26.35,9.84 | v7.62,12.54 7.49,12.41 U$72.A
  Bottom 0.508: U$29.A v48.13,37.3 | v48.13,60.16 U$15.A | U$43.A v48.13,14.45 | SV5.7 29.53,55.14 35.24,49.42 v35.24,37.3 v35.24,22.22 v35.24,14.76 32.7,14.76 30.35,12.41 U$57.A v30.35,9.84 | v7.62,12.54 7.49,12.41 U$72.A 8.72,9.99 26.2,9.99 v26.35,9.84
N$17  (via drill 0.5)
  Top 0.508: v38.42,78.26 52.9,78.26 SV3.1 | IC1.9 24.13,50.64 27.78,54.29 29.69,54.29 v30.8,55.4
  Bottom 0.508: v30.8,55.4 30.8,61.75 33.34,64.29 33.34,71.44 38.42,76.52 v38.42,78.26
N$18  (via drill 0.5)
  Top 0.508: v36.2,77.15 51.78,77.15 52.26,76.67 54.48,76.67 SV3.2 | IC1.10 24.13,51.91 28.1,55.88 v28.1,58.58
  Bottom 0.508: v36.2,77.15 32.23,73.18 32.23,64.77 28.1,60.64 v28.1,58.58
N$19
  Top 0.508: U$50.C 2.27,51.39 2.27,58.52 C6.1 2.27,58.63 2.27,60.8 IC4.8
N$20
  Top 0.813: X1.4 5.54,33.01 6.35,33.81 6.35,45.92 U$50.A
N$21
  Top 0.508: IC1.6 26.51,46.83 29.05,44.29 29.05,40.16 34.13,35.08 50.35,35.08 SV2.1
N$22
  Top 0.508: IC3.6 2.86,24.61 2.54,24.92 2.54,39.21 3.34,40.01 X1.2
N$23
  Top 0.508: SV3.3 U$1.C
N$24
  Top 0.508: SV3.5 U$2.C
N$25
  Top 0.508: SV3.7 U$3.C
N$26
  Top 0.508: SV3.9 U$4.C
N$27
  Top 0.508: SV3.11 U$5.C
N$28
  Top 0.508: SV3.13 U$6.C
N$29
  Top 0.508: SV3.15 U$7.C
N$30
  Top 0.508: 16.03,72.86 16.03,70.33 | 16.03,70.33 16.03,67.78 | 16.03,67.78 16.03,65.25 | 16.03,65.25 16.03,62.7 | S1.15 S3.15 16.03,62.7 | S1.14 S3.14 16.03,65.25 | S1.12 S3.12 16.03,70.33 | S1.11 S3.11 16.03,72.86 | S1.10 15.54,75.41 16.02,74.93 16.03,74.93 16.03,72.86 | IC1.11 21.43,53.18 16.03,58.58 16.03,60.16 | 16.03,60.16 16.03,62.7 | S3.10 S1.10 | R5.2 10.18,75.41 S1.10 | 16.03,60.16 S3.16 S1.16 | 16.03,67.78 S3.13 S1.13
N$31
  Top 0.508: U$8.C 33.7,75.41 31.9,73.6 24.98,73.6 23.18,75.41 S1.7 S3.7
N$32
  Top 0.508: U$9.C 33.86,72.71 33.54,72.39 23.67,72.39 23.19,72.86 S3.6 S1.6
N$33
  Top 0.508: U$10.C S1.5 S3.5
N$34
  Top 0.508: S3.4 S1.4 U$11.C
N$35
  Top 0.508: S3.3 S1.3 U$12.C
N$36
  Top 0.508: S3.2 S1.2 U$13.C
N$37
  Top 0.508: S3.1 S1.1 U$14.C
N$38
  Bottom 0.508: U$15.C 51.42,58.9 54.48,58.9 SV3.16
N$39
  Bottom 0.508: U$16.C 51.42,61.44 54.48,61.44 SV3.14
N$40
  Bottom 0.508: U$17.C 51.42,63.98 54.48,63.98 SV3.12
N$41
  Bottom 0.508: U$18.C 51.42,66.52 54.48,66.52 SV3.10
N$42
  Bottom 0.508: U$19.C 51.42,69.06 54.48,69.06 SV3.8
N$43
  Bottom 0.508: U$20.C 51.42,71.59 54.48,71.59 SV3.6
N$44
  Bottom 0.508: U$21.C 51.42,74.14 54.48,74.14 SV3.4
N$45
  Top 0.508: IC3.7 2.7,23.34 1.75,24.29 1.75,42.38 2.87,43.51 X1.1
N$46
  Top 0.508: LED2.C R4.2
N$47
  Top 0.508: LED1.A R3.1
N$48  (via drill 0.5)
  Top 0.508: v8.41,68.74 8.73,68.42 T1.B | R5.1 10.16,71.44 v9.68,70.96
  Bottom 0.508: v9.68,70.96 9.68,70.01 v8.41,68.74
N$49
  Top 0.508: T1.C 9.21,70 8.66,70 7.97,70.55 LED3.A
N$50
  Top 0.508: LED3.C 5.78,71.66 6.03,71.91 7.78,71.91 8.1,72.23 R6.2
N$51
  Top 0.508: IC1.5 26.51,45.56 28.1,43.97 28.1,39.84 33.81,34.13 49.24,34.13 52.42,30.95 54.48,30.95 SV2.2
N$52
  Top 0.508: SV1.1 32.07,55.09 30.16,53.18 28.1,53.18 24.29,49.37 IC1.8
N$53
  Top 0.508: SV1.2 54.48,53.81 52.58,53.81 52.28,54.11 32.68,54.11 30.8,52.23 28.57,52.23 24.45,48.1 IC1.7
N$54
  Top 0.508: SV1.3 U$22.C
N$55
  Top 0.508: SV1.5 U$23.C
N$56
  Top 0.508: SV1.7 U$24.C
N$57
  Top 0.508: SV1.9 U$25.C
N$58
  Top 0.508: SV1.11 U$26.C
N$59
  Top 0.508: SV1.13 U$27.C
N$60
  Top 0.508: SV1.15 U$28.C
N$61
  Bottom 0.508: U$29.C 51.1,36.03 54.48,36.03 SV1.16
N$62
  Bottom 0.508: U$30.C 51.1,38.58 54.48,38.58 SV1.14
N$63
  Bottom 0.508: U$31.C 51.1,41.12 54.48,41.12 SV1.12
N$64
  Bottom 0.508: U$32.C 51.1,43.66 54.48,43.66 SV1.10
N$65
  Bottom 0.508: U$33.C 51.1,46.2 54.48,46.2 SV1.8
N$66
  Bottom 0.508: U$34.C 51.1,48.73 54.48,48.73 SV1.6
N$67
  Bottom 0.508: U$35.C 51.1,51.27 54.48,51.27 SV1.4
N$68
  Top 0.508: SV2.3 U$36.C
N$69
  Top 0.508: SV2.5 U$37.C
N$70
  Top 0.508: SV2.7 U$38.C
N$71
  Top 0.508: SV2.9 U$39.C
N$72
  Top 0.508: SV2.11 U$40.C
N$73
  Top 0.508: SV2.13 U$41.C
N$74
  Top 0.508: SV2.15 U$42.C
N$75
  Bottom 0.508: U$43.C 51.1,13.18 54.48,13.18 SV2.16
N$76
  Bottom 0.508: U$44.C 51.1,15.71 54.48,15.71 SV2.14
N$77
  Bottom 0.508: U$45.C 51.1,18.25 54.48,18.25 SV2.12
N$78
  Bottom 0.508: U$46.C 51.1,20.8 54.48,20.8 SV2.10
N$79
  Bottom 0.508: U$47.C 51.1,23.34 54.48,23.34 SV2.8
N$80
  Bottom 0.508: U$48.C 51.1,25.88 54.48,25.88 SV2.6
N$81
  Bottom 0.508: U$49.C 51.1,28.41 54.48,28.41 SV2.4
N$82  (via drill 0.5)
  Top 0.508: IC1.4 v26.35,44.29 | v30,44.29 36.99,44.29 37.47,43.81 v43.97,43.81
  Bottom 0.508: SV4.1 48.13,11.24 46.99,12.38 45.72,12.38 43.97,14.13 v43.97,43.81 | v30,44.29 v26.35,44.29
N$83  (via drill 0.5)
  Top 0.508: SV4.2 48.13,3.03 49.56,4.46 49.56,9.81 46.99,12.38 45.72,12.38 44.93,13.18 v44.93,14.61 | v44.45,48.58 44.29,48.42 34.45,48.42 34.13,48.1 v26.04,48.1 | v20.32,48.1 IC1.18
  Bottom 0.508: v44.93,14.61 44.93,48.1 v44.45,48.58 | v26.04,48.1 v20.32,48.1
N$84  (via drill 0.5)
  Top 0.508: v20.32,49.37 IC1.17 | v27.15,49.37 v33.5,49.37
  Bottom 0.508: SV7.1 28.1,5.71 28.73,6.35 28.73,12.22 34.29,17.78 34.29,48.58 v33.5,49.37 | v20.32,49.37 v27.15,49.37
N$85  (via drill 0.5)
  Top 0.508: IC1.20 v20.32,45.56 | v27.62,47.15 33.02,47.15 v33.18,46.99
  Bottom 0.508: SV7.2 23.97,4.48 23.97,6.51 24.77,7.3 27.46,7.3 27.78,7.62 27.78,12.7 33.34,18.26 33.34,46.83 v33.18,46.99 | v20.32,45.56 21.91,47.15 v27.62,47.15
N$86
  Top 0.305: IC1.19 11.9,46.83 9.84,44.77 SV6.1
N$87
  Top 0.305: SV6.2 10.32,47.31 11.59,48.58 11.59,52.55 12.22,53.18 IC1.14
N$88
  Top 0.305: IC1.13 12.22,54.45 11.43,53.66 8.1,53.66 7.62,53.18 7.62,50.32 8.1,49.85 SV6.3
N$89  (via drill 0.5)
  Top 0.305: v14.92,50.64 IC1.16
  Bottom 0.305: SV6.4 13.18,52.39 v14.92,50.64
N$90
  Top 0.305: IC1.15 14.76,51.91 15.24,52.39 15.24,55.4 14.61,56.04 11.27,56.04 10.16,54.93 SV6.5
N$96
  Bottom 0.508: U$65.C SV7.3
N$97
  Bottom 0.508: U$66.C SV7.5
N$98
  Bottom 0.508: SV4.3 U$51.C
N$99
  Bottom 0.508: SV4.5 U$52.C
N$100
  Bottom 0.508: SV4.7 U$53.C
N$101
  Bottom 0.508: SV4.9 U$54.C
N$102
  Bottom 0.508: SV4.11 U$55.C
N$103
  Bottom 0.508: SV4.13 U$56.C
N$104
  Bottom 0.508: SV4.15 U$57.C
N$105
  Top 0.406: U$58.C 31.62,6.4 31.62,4.29 SV4.16
N$106
  Top 0.406: U$59.C 34.16,6.4 34.16,4.29 SV4.14
N$107
  Top 0.406: U$60.C 35.43,7.46 36.7,6.19 36.7,4.29 SV4.12
N$108
  Top 0.406: U$61.C 39.24,6.4 39.24,4.29 SV4.10
N$109
  Top 0.406: U$62.C 40.51,7.46 41.78,6.19 41.78,4.29 SV4.8
N$110
  Top 0.406: U$63.C 44.32,6.4 44.32,4.29 SV4.6
N$111
  Top 0.406: U$64.C 46.86,6.4 46.86,4.29 SV4.4
N$112
  Bottom 0.508: U$67.C SV7.7
N$113
  Bottom 0.508: U$68.C SV7.9
N$114
  Bottom 0.508: U$69.C SV7.11
N$115
  Bottom 0.508: U$70.C SV7.13
N$116
  Bottom 0.508: U$71.C SV7.15
N$117
  Top 0.508: U$72.C 8.76,6.55 8.76,4.45 SV7.16
N$118
  Top 0.508: U$73.C 11.3,6.55 11.3,4.45 SV7.14
N$119
  Top 0.508: U$74.C 13.84,6.55 13.84,4.45 SV7.12
N$120
  Top 0.508: U$75.C 16.38,6.55 16.38,4.45 SV7.10
N$121
  Top 0.508: U$76.C 18.92,6.55 18.92,4.13 17.97,3.17 SV7.8
N$122
  Top 0.508: U$77.C 21.46,6.55 21.46,4.45 SV7.6
N$123
  Top 0.508: U$78.C 24,6.55 24,4.29 22.89,3.17 SV7.4
VCC
  Top 0.508: IC1.1 23.81,40.48 23.81,38.58 | 23.81,38.58 23.81,36.67 23.18,36.03 19.37,36.03 18.26,34.92 18.26,33.49 | 7.36,58.58 7.36,60.8 IC4.1 10.48,60.8 10.48,67.32 T1.E | 7.36,58.58 7.36,56.6 C8.1 6.64,49.85 7.52,48.96 7.52,40 8.16,39.37 11.17,39.37 | 11.17,39.37 11.17,33.49 | 9.59,32.23 9.59,33.49 11.17,33.49 | 11.17,39.37 11.27,39.37 12.38,40.48 IC1.24 | LED2.A 4.29,17.3 4.29,22.01 IC3.8 5.71,22.07 6.35,22.7 6.35,27.78 | 6.35,27.78 6.35,28.79 7.25,29.68 R2.2 9.59,29.64 9.59,32.23 | R1.2 9.59,32.23 | 18.26,33.49 18.26,27.94 19.05,27.14 IC2.14 24.07,27.14 C4.1 | 11.17,33.49 18.26,33.49 | C3.1 6.35,27.78 | C5.1 23.81,38.58 | C7.1 7.36,58.58

### Text on the board
tPlace: 7 | 6 | ERR | 5 | 4 | 3 | 2 | 1 | TX | PWR | SCH: Paco http://usuaris.tinet.cat/fmco/ / CAD: Mikael Sundin 2019